# EAGLE schematic untitled (EAGLE 9.5.2)
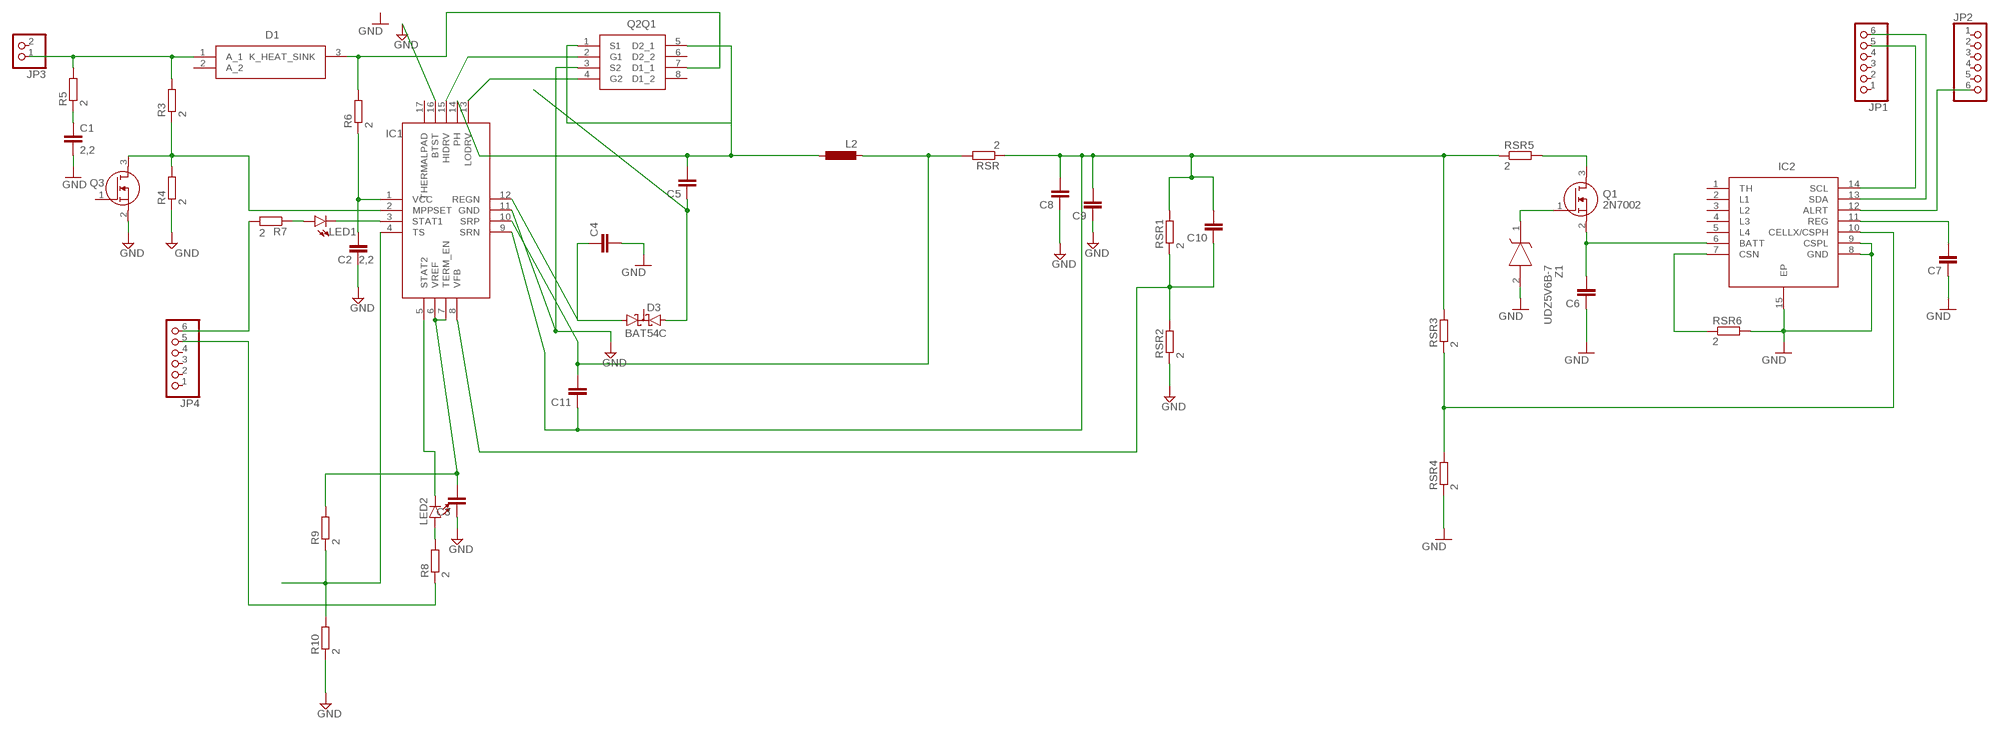
[diagram p0: schematic, sheet 1]

## Parts
C1  2,2  C-EUC0805K  [C0805K]
C2  2,2  C-EUC0805K  [C0805K]
C3  2,2  C-EUC0805K  [C0805K]
C4  2,2  C-EUC0805K  [C0805K]
C5  2,2  C-EUC0805K  [C0805K]
C6  2,2  C-EUC0805K  [C0805K]
C7  2,2  C-EUC0805K  [C0805K]
C8  2,2  C-EUC0805K  [C0805K]
C9  2,2  C-EUC0805K  [C0805K]
C10  2,2  C-EUC0805K  [C0805K]
C11  2,2  C-EUC0805K  [C0805K]
D1  PDS1040Q-13  [PDS104013]
D3  BAT54C  [SOT23]
IC1  BQ24650RVAT  [QFN50P350X350X100-17N]
IC2  MAX17263LETD+  [SON40P300X300X80-15N]
JP1  PINHD-1X6  [1X06]
JP2  PINHD-1X6  [1X06]
JP3  PINHD-1X2  [1X02]
JP4  PINHD-1X6  [1X06]
L2  L-EUL2825P  [L2825P]
LED1  LAP4-BOTTOM  [P47F-BOTTOM]
LED2  LAP4-BOTTOM  [P47F-BOTTOM]
Q1  2N7002  [SOT96P240X120-3N]
Q2Q1  SI7288DP-T1-GE3  [POWERPAK-SO8_1]
Q3  2N7002  [SOT96P240X120-3N]
R3  2  R-EU_M1206  [M1206]
R4  2  R-EU_M1206  [M1206]
R5  2  R-EU_M1206  [M1206]
R6  2  R-EU_M1206  [M1206]
R7  2  R-EU_M1206  [M1206]
R8  2  R-EU_M1206  [M1206]
R9  2  R-EU_M1206  [M1206]
R10  2  R-EU_M1206  [M1206]
RSR  2  R-EU_M1206  [M1206]
RSR1  2  R-EU_M1206  [M1206]
RSR2  2  R-EU_M1206  [M1206]
RSR3  2  R-EU_M1206  [M1206]
RSR4  2  R-EU_M1206  [M1206]
RSR5  2  R-EU_M1206  [M1206]
RSR6  2  R-EU_M1206  [M1206]
Z1  UDZ5V6B-7  [SOD2513X120N]

## Nets
GND: C1.2 C2.1 C3.1 C4.2 C6.1 C7.1 C8.1 C9.1 IC1.11(GND) IC1.16(BTST) IC2.8(GND) IC2.9(CSPL) IC2.15(EP) Q2Q1.3(S2) Q3.2(S) R4.1 R10.1 RSR2.1 RSR4.1 RSR6.2 Z1.2(A)
N$1: C4.1 D3.1(A1) IC1.12(REGN)
N$2: C11.2 IC1.10(SRP) L2.2 RSR.2
N$3: IC2.14(SCL) JP1.5
N$4: C2.2 IC1.1(VCC) R6.1
N$5: C5.1 D3.2(A2)
N$6: IC1.2(MPPSET) Q3.3(D) R3.1 R4.2
N$7: C1.1 R5.1
N$8: LED1.A R7.1
N$9: C3.2 IC1.6(VREF) IC1.7(TERM_EN) R9.2
N$10: C6.2 IC2.6(BATT) Q1.2(S)
N$11: IC1.3(STAT1) LED1.C
N$12: C5.2 IC1.14(PH) L2.1 Q2Q1.1(S1) Q2Q1.5(D2_1)
N$13: IC1.5(STAT2) LED2.C
N$14: LED2.A R8.2
N$15: IC1.15(HIDRV) Q2Q1.2(G1)
N$16: IC1.13(LODRV) Q2Q1.4(G2)
N$17: Q1.1(G) Z1.1(K)
N$18: D1.3(K_HEAT_SINK) Q2Q1.7(D1_1) R6.2
N$19: Q1.3(D) RSR5.2
N$20: C7.2 IC2.11(REG)
N$21: C8.2 C9.2 C10.2 C11.1 IC1.9(SRN) RSR1.2 RSR3.2 RSR5.1 RSR.1
N$22: IC2.10(CELLX/CSPH) RSR3.1 RSR4.2
N$23: IC2.13(SDA) JP1.6
N$24: IC2.12(ALRT) JP2.6
N$25: C10.1 IC1.8(VFB) RSR1.1 RSR2.2
N$26: IC2.7(CSN) RSR6.1
N$27: D1.1(A_1) JP3.1 R3.2 R5.2
N$28: JP4.6 R7.2
N$29: JP4.5 R8.1
R3: IC1.4(TS) R9.1 R10.2
Unconnected: D1.2(A_2) D3.3(CC) IC1.17(THERMALPAD) IC2.1(TH) IC2.2(L1) IC2.3(L2) IC2.4(L3) IC2.5(L4) JP1.1 JP1.2 JP1.3 JP1.4 JP2.1 JP2.2 JP2.3 JP2.4 JP2.5 JP3.2 JP4.1 JP4.2 JP4.3 JP4.4 Q2Q1.6(D2_2) Q2Q1.8(D1_2) Q3.1(G)

## Library data of the parts
C1-C11 = rcl:C-EU: CAPACITOR, European symbol; SPICEPREFIX: C
D1 = SamacSys_Parts:PDS1040Q-13: Schottky Diodes & Rectifiers Schottky Rectifier Source: Datasheet <https://componentsearchengine.com/Datasheets/1/PDS1040Q-13.pdf>; DESCRIPTION: Schottky Diodes & Rectifiers Schottky Rectifier; HEIGHT: 1mm; MANUFACTURER_NAME: Diodes Inc.; MANUFACTURER_PART_NUMBER: PDS1040Q-13; MOUSER_PART_NUMBER: 621-PDS1040Q-13; MOUSER_PRICE-STOCK: https://www.mouser.com/Search/Refine.aspx?Keyword=621-PDS1040Q-13
D3 = diode:BAT54C: Schottky Diodes Source: Fairchild .. BAT54.pdf
IC1 = SamacSys_Parts:BQ24650RVAT: Battery Charge Controller MPPT VQFN16 Texas Instruments BQ24650RVAT, Battery Charge Controller Lead-Acid, Lithium, Lithium-Ion, Lithium-Polymer, 16-Pin VQFN Source: Datasheet <http://www.ti.com/lit/ds/slusa75a/slusa75a.pdf>; DESCRIPTION: Battery Charge Controller MPPT VQFN16 Texas Instruments BQ24650RVAT, Battery Charge Controller Lead-Acid, Lithium, Lithium-Ion, Lithium-Polymer, 16-Pin VQFN; HEIGHT: 1mm; MANUFACTURER_NAME: Texas Instruments; MANUFACTURER_PART_NUMBER: BQ24650RVAT; MOUSER_PART_NUMBER: 595-BQ24650RVAT; MOUSER_PRICE-STOCK: https://www.mouser.com/Search/Refine.aspx?Keyword=595-BQ24650RVAT
IC2 = SamacSys_Parts:MAX17263LETD+: MAXIM INTEGRATED PRODUCTS - MAX17263LETD+ - SINGLE/MULTI-CELL FUEL GAUGE Source: Datasheet <https://componentsearchengine.com/Datasheets/1/MAX17263LETD .pdf>; DESCRIPTION: MAXIM INTEGRATED PRODUCTS - MAX17263LETD+ - SINGLE/MULTI-CELL FUEL GAUGE; HEIGHT: 0.8mm; MANUFACTURER_NAME: Maxim Integrated; MANUFACTURER_PART_NUMBER: MAX17263LETD+; MOUSER_PART_NUMBER: 700-MAX17263LETD+; MOUSER_PRICE-STOCK: https://www.mouser.com/Search/Refine.aspx?Keyword=700-MAX17263LETD%2B
JP1 JP2 JP4 = pinhead:PINHD-1X6: PIN HEADER
JP3 = pinhead:PINHD-1X2: PIN HEADER
L2 = rcl:L-EU: INDUCTOR, European symbol; SPICEPREFIX: L
LED1 LED2 = led:*P4: PointLED® Enhanced Thinfilm LED TOP & BOTTOM mount LS P47F, LR P47F, LA P47F, LY P47F, LT P4SG, LB P4SG, LW P4SG Source: http://catalog.osram-os.com .. LA_LR_LS_LY_P47F_Pb_free.pdf
Q1 Q3 = SamacSys_Parts:2N7002: N-channel MOSFET,2N7002 0.115A 60V Source: Datasheet <https://componentsearchengine.com/Datasheets/1/2N7002.pdf>; DESCRIPTION: N-channel MOSFET,2N7002 0.115A 60V; HEIGHT: 1.2mm; MANUFACTURER_NAME: ON Semiconductor; MANUFACTURER_PART_NUMBER: 2N7002; MOUSER_PART_NUMBER: 512-2N7002; MOUSER_PRICE-STOCK: https://www.mouser.com/Search/Refine.aspx?Keyword=512-2N7002
Q2Q1 = SamacSys_Parts:SI7288DP-T1-GE3: Trans MOSFET N-CH 40V 10An Vishay SI7288DP-T1-GE3 Dual N-channel MOSFET Transistor, 20 A, 40 V, 8-Pin PowerPAK SO Source: Datasheet <https://componentsearchengine.com/Datasheets/1/SI7288DP-T1-GE3.pdf>; DESCRIPTION: Trans MOSFET N-CH 40V 10An Vishay SI7288DP-T1-GE3 Dual N-channel MOSFET Transistor, 20 A, 40 V, 8-Pin PowerPAK SO; HEIGHT: mm; MANUFACTURER_NAME: Vishay; MANUFACTURER_PART_NUMBER: SI7288DP-T1-GE3; MOUSER_PART_NUMBER: 781-SI7288DP-T1-GE3; MOUSER_PRICE-STOCK: https://www.mouser.com/Search/Refine.aspx?Keyword=781-SI7288DP-T1-GE3
R3-R10 RSR RSR1-RSR6 = rcl:R-EU_: RESISTOR, European symbol; SPICEPREFIX: R
Z1 = SamacSys_Parts:UDZ5V6B-7: Diodes Inc UDZ5V6B-7 Zener Diode, 5.6V 2% 200 mW SMT 2-Pin SOD-323 Source: Datasheet <https://componentsearchengine.com/Datasheets/1/UDZ5V6B-7.pdf>; DESCRIPTION: Diodes Inc UDZ5V6B-7 Zener Diode, 5.6V 2% 200 mW SMT 2-Pin SOD-323; HEIGHT: 1.2mm; MANUFACTURER_NAME: Diodes Inc.; MANUFACTURER_PART_NUMBER: UDZ5V6B-7; MOUSER_PART_NUMBER: 621-UDZ5V6B-7; MOUSER_PRICE-STOCK: https://www.mouser.com/Search/Refine.aspx?Keyword=621-UDZ5V6B-7